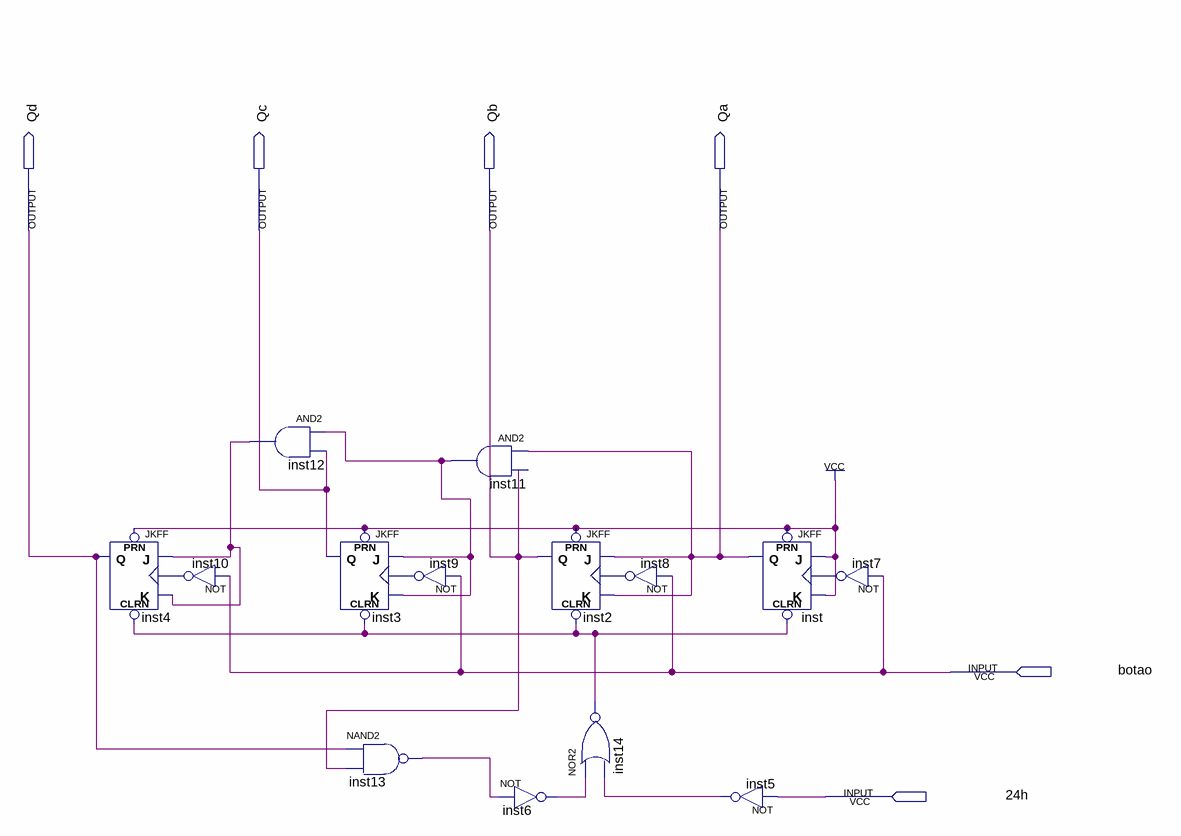
[diagram p0: schematic sheet]
// Quartus schematic Block1.bdf as structural Verilog: 14 symbols, 6 pins
module Block1 (
  input  botao,
  input  \24h ,
  output Qd,
  output Qc,
  output Qb,
  output Qa
);

  wire inst5_out, inst6_out, inst7_out, inst8_out, inst9_out, inst10_out, inst11_out, inst12_out, inst13_out,
       inst14_out;

  JKFF inst4 (.PRN(1'b1), .CLRN(inst14_out), .K(inst12_out), .J(inst12_out), .CLK(inst10_out), .Q(Qd));
  not inst10 (inst10_out, botao);
  and inst12 (inst12_out, inst11_out, Qc);
  JKFF inst3 (.PRN(1'b1), .CLRN(inst14_out), .K(inst11_out), .J(inst11_out), .CLK(inst9_out), .Q(Qc));
  nand inst13 (inst13_out, Qd, Qb);
  and inst11 (inst11_out, Qa, Qb);
  not inst9 (inst9_out, botao);
  JKFF inst2 (.PRN(1'b1), .CLRN(inst14_out), .K(Qa), .J(Qa), .CLK(inst8_out), .Q(Qb));
  not inst6 (inst6_out, inst13_out);
  not inst8 (inst8_out, botao);
  nor inst14 (inst14_out, inst6_out, inst5_out);
  JKFF inst (.PRN(1'b1), .CLRN(inst14_out), .K(1'b1), .J(1'b1), .CLK(inst7_out), .Q(Qa));
  not inst5 (inst5_out, \24h );
  not inst7 (inst7_out, botao);
endmodule
